# EAGLE design stepdown-power (EAGLE 5.06)
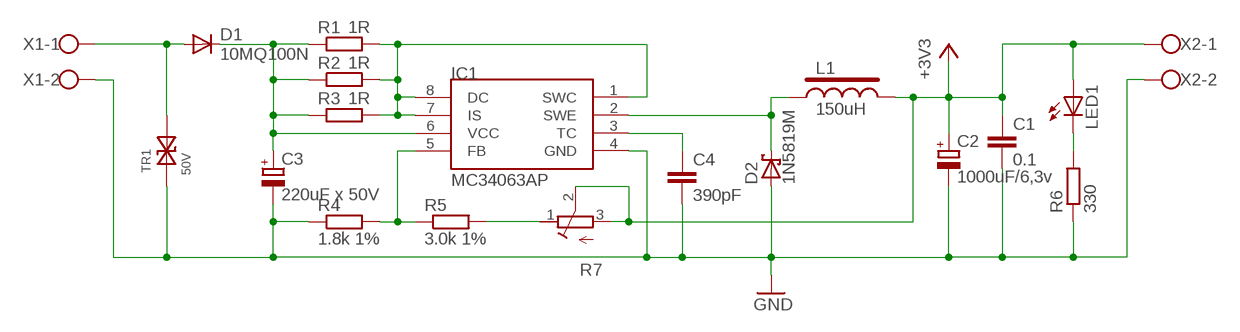
[diagram p0: schematic, sheet 1]

## Parts
C1  0.1  C-C0805  [C0805]
C2  1000uF/6,3v  CPOL-E5-10.5  [E5-10,5]
C3  220uF x 50V  CPOL-E5-10.5  [E5-10,5]
C4  390pF  C-C0805  [C0805]
D1  10MQ100N  DIODE-SMB  [SMB]
D2  1N5819M  SCHOTTKY-MELF  [MELF-MLL41]
IC1  MC34063AP  [DIL08]
L1  150uH  LRCH895  [RCH895]
LED1  LED3MM  [LED3MM]
R1  1R  R-R0805  [R0805]
R2  1R  R-R0805  [R0805]
R3  1R  R-R0805  [R0805]
R4  1.8k 1%  R-R0805  [R0805]
R5  3.0k 1%  R-R0805  [R0805]
R6  330  R-R0805  [R0805]
R7  RTRIM  [RTRIM-3362P]
TR1  50V  TRANSIL-SMB  [SMB]
X1  AK500/2  [AK500/2]
X2  AK500/2  [AK500/2]

## Nets
+3V3: C1.1 C2.+ L1.2 LED1.A R7.2(S) R7.3(E) X2.1
GND: C1.2 C2.- C3.- C4.2 D2.A IC1.4(GND) R4.1 R6.1 TR1.A X1.2 X2.2
N$1: C4.1 IC1.3(TC)
N$2: D2.C IC1.2(SWE) L1.1
N$3: LED1.K(C) R6.2
N$4: D1.A TR1.C X1.1
N$5: IC1.5(FB) R4.2 R5.1
N$6: IC1.1(SWC) IC1.7(IS) IC1.8(DC) R1.2 R2.2 R3.2
N$7: R5.2 R7.1(A)
VPOW: C3.+ D1.C IC1.6(VCC) R1.1 R2.1 R3.1

## Library data of the parts
C1 C4 = rs485:C-: CAPACITOR, European symbol
C2 C3 = rs485:CPOL-: POLARIZED CAPACITOR, European symbol
D1 = rs485:DIODE-: DIODE
D2 = rs485:SCHOTTKY-: Schottky Diode
IC1 = rs485:MC34063: 1.5 A, Step-Up/Down/Inverting Switching Regulator
L1 = rs485:L: Inductors
LED1 = rs485:LED: LED OSRAM: - CHIPLED LG R971, LG N971, LY N971, LG Q971, LY Q971, LO R971, LY R971 LH N974, LH R974 LS Q976, LO Q976, LY Q976 LO Q996 - Hyper CHIPLED LW Q18S LB Q993, LB Q99A, LB R99A - SideLED LS A670, LO A670, LY A670, LG A670, LP A670 LB A673, LV A673, LT A673, LW A673 LH A674 LY A675 LS A676, LA A676, LO A676, LY A676, LW A676 LS A679, LY A679, LG A679 - Hyper Micro SIDELED® LS Y876, LA Y876, LO Y876, LY Y876 LT Y87S - SmartLED LW L88C, LW L88S LB L89C, LB L89S, LG L890 LS L89K, LO L89K, LY L89K LS L896, LA L896, LO L896, LY L896 - TOPLED LS T670, LO T670, LY T670, LG T670, LP T670 LSG T670, LSP T670, LSY T670, LOP T670, LYG T670 LG T671, LOG T671, LSG T671 LB T673, LV T673, LT T673, LW T673 LH T674 LS T676, LA T676, LO T676, LY T676, LB T676, LH T676, LSB T676, LW T676 LB T67C, LV T67C, LT T67C, LS T67K, LO T67K, LY T67K, LW E67C LS E67B, LA E67B, LO E67B, LY E67B, LB E67C, LV E67C, LT E67C LW T67C LS T679, LY T679, LG T679 LS T770, LO T770, LY T770, LG T770, LP T770 LB T773, LV T773, LT T773, LW T773 LH T774 LS E675, LA E675, LY E675, LS T675 LS T776, LA T776, LO T776, LY T776, LB T776 LHGB T686 LT T68C, LB T68C - Hyper Mini TOPLED® LB M676 - Mini TOPLED Santana® LG M470 LS M47K, LO M47K, LY M47K Source: http://www.osram.convergy.de - LUMILED® LXK2-PW12-R00, LXK2-PW12-S00, LXK2-PW14-U00, LXK2-PW14-V00 LXK2-PM12-R00, LXK2-PM12-S00, LXK2-PM14-U00 LXK2-PE12-Q00, LXK2-PE12-R00, LXK2-PE12-S00, LXK2-PE14-T00, LXK2-PE14-U00 LXK2-PB12-K00, LXK2-PB12-L00, LXK2-PB12-M00, LXK2-PB14-N00, LXK2-PB14-P00, LXK2-PB14-Q00 LXK2-PR12-L00, LXK2-PR12-M00, LXK2-PR14-Q00, LXK2-PR14-R00 LXK2-PD12-Q00, LXK2-PD12-R00, LXK2-PD12-S00 LXK2-PH12-R00, LXK2-PH12-S00 LXK2-PL12-P00, LXK2-PL12-Q00, LXK2-PL12-R00 Source: www.luxeon.com
R1-R6 = rs485:R-: RESISTOR, European symbol
R7 = lcd-char:RTRIM
TR1 = rs485:TRANSIL-: Transil BIDIR.
X1 X2 = rs485:AK500/2: CONNECTOR

## Board
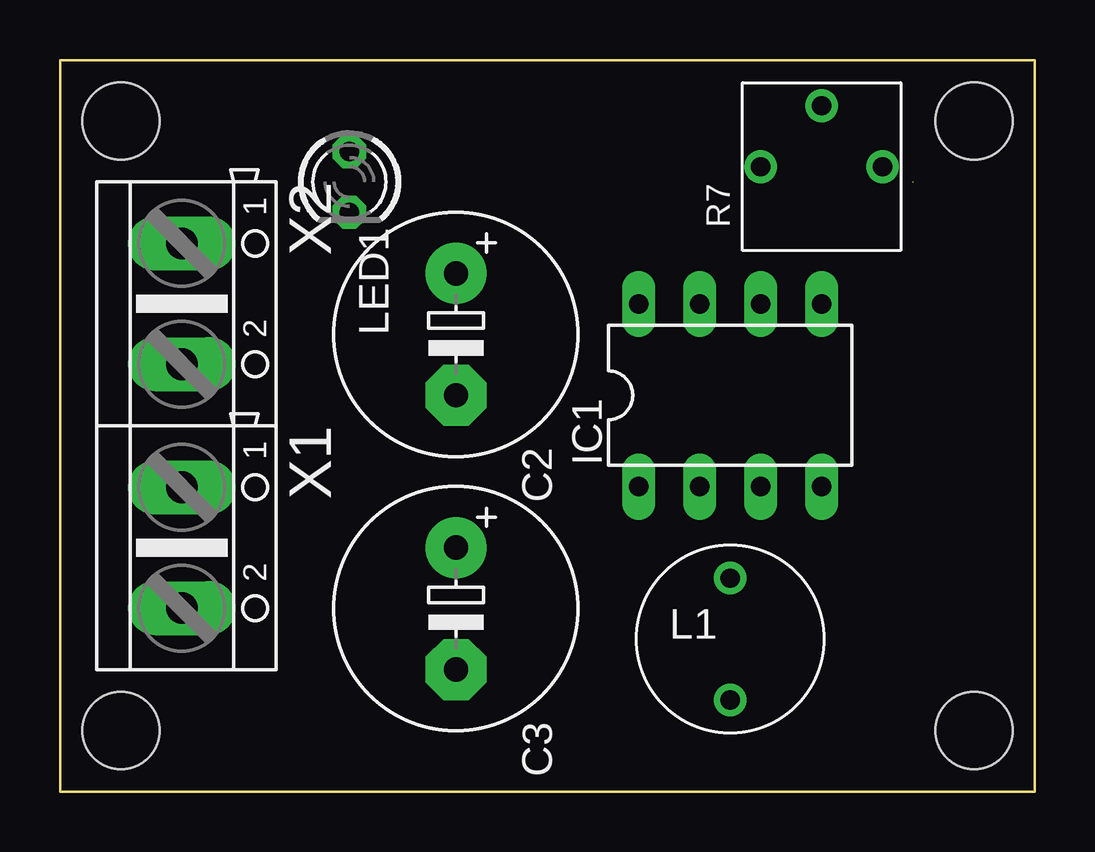
[diagram p1: board, top side]
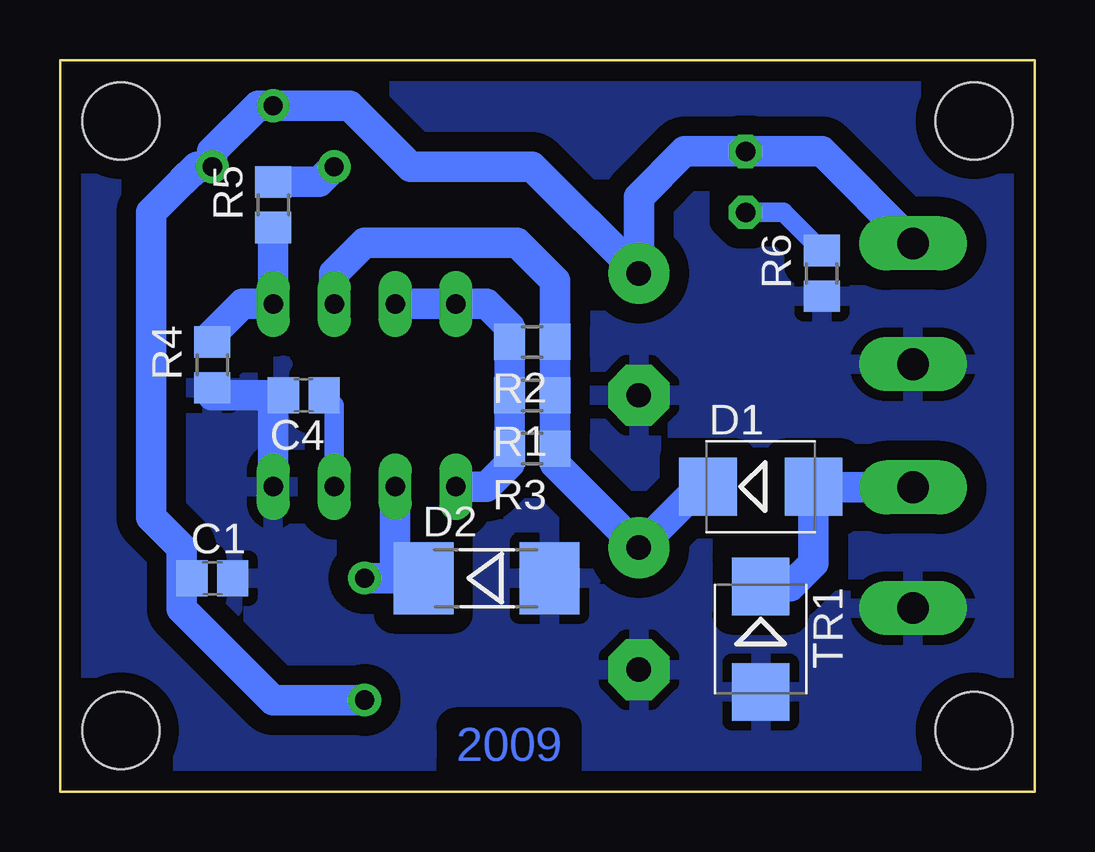
[diagram p2: board, bottom side, seen from below]

Size 40.64 x 30.48 mm. Coordinates in mm from the lower left corner, seen from the top.
Outline: 0,0 40.64,0 40.64,30.48 0,30.48 0,0
Copper layers (1*16): Top 0.035mm / dielectric 1.5mm / Bottom 0.035mm
Design rules "default *": minimum track width 10mil, minimum drill 24mil, track to track 8mil, track to pad 8mil, pad to pad 8mil, via to via 8mil, smd to smd 8mil, copper to edge 0.5mm, drill to drill 8mil, minimum pad ring 10mil, minimum via ring 8mil, stop-mask expansion 4mil, vias tented up to drill 0mil, thermal gap 16mil
Holes 3.2 mm at 2.54,2.54 38.1,2.54 38.1,27.94 2.54,27.94

### Footprints (pad centres in the part's own frame; a part is rotated, then mirrored left to right if it is on the bottom)
C0805 = smd 1.3 x 1.5: 1 -0.85,0; 2 0.85,0
E5-10,5 = drill 1.016 pad 2.54 round: + -2.54,0 | drill 1.016 pad 2.54 octagon: - 2.54,0
SMB = smd 2.4 x 2.4: A 2.2,0; C -2.2,0
MELF-MLL41 = smd 2.5 x 3: A 2.625,0; C -2.625,0
DIL08 = drill 0.813 long: 1 -3.81,-3.81; 2 -1.27,-3.81; 3 1.27,-3.81; 4 3.81,-3.81; 5 3.81,3.81; 6 1.27,3.81; 7 -1.27,3.81; 8 -3.81,3.81
RCH895 = drill 0.8 round: 1 0,2.54; 2 0,-2.54
LED3MM = drill 0.813 octagon: A -1.27,0; K 1.27,0
R0805 = smd 1.3 x 1.5: 1 -0.95,0; 2 0.95,0
RTRIM-3362P = drill 0.8 round: 1 -2.54,0; 2 0,2.54; 3 2.54,0
AK500/2 = drill 1.321 long: 1 -2.515,0; 2 2.515,0

### Placement (x,y rotation side)
C1  34.29,8.89 0 bottom
C2  16.51,19.05 270 top
C3  16.51,7.62 270 top
C4  30.48,16.51 180 bottom
D1  11.43,12.7 0 bottom
D2  22.86,8.89 0 bottom
IC1  27.94,16.51 0 top
L1  27.94,6.35 0 top
LED1  12.06,25.4 270 top
R1  20.95,16.51 180 bottom
R2  20.95,18.73 180 bottom
R3  20.95,14.29 180 bottom
R4  34.29,17.78 90 bottom
R5  31.75,24.45 90 bottom
R6  8.89,21.59 90 bottom
R7  31.75,26.04 0 top
TR1  11.43,6.35 270 bottom
X1  5.08,10.16 270 top
X2  5.08,20.32 270 top

### Tracks (layer width: path | path; a pad name or v marks a point on that pad's centre or on a via)
+3V3  (1 unrouted)
  Bottom 1.27: X2.1 5.08,22.86 8.89,26.67 LED1.A 14.61,26.67 16.51,24.77 C2.+ 20.95,26.04 26.04,26.04 28.57,28.57 R7.2 32.38,28.57 34.29,26.67 R7.3 34.92,26.04 35.56,25.4 | L1.2 31.75,3.81 35.56,7.62 35.56,8.89 | 35.56,25.4 36.83,24.13 36.83,11.43 35.56,10.16 35.56,8.89 | 35.56,8.89 C1.1
GND
  Bottom 1.27: R4.1 34.29,16.51 C4.2 31.75,16.09 IC1.4
  pour Bottom (isolate 0.813): -1.27,-1.27 41.91,-1.27 41.91,31.75 -1.27,31.75
N$1
  Bottom 0.813: C4.1 29.21,16.09 IC1.3
N$2
  Bottom 1.27: IC1.2 26.67,8.89 L1.1 D2.C
N$3
  Bottom 0.813: R6.2 10.48,24.13 LED1.K
N$4
  Bottom 1.27: X1.1 9.21,12.68 D1.A 9.23,9.5 10.18,8.55 TR1.C
N$5
  Bottom 1.27: R5.1 IC1.5 33.02,20.32 34.29,19.05 R4.2
N$6
  Bottom 1.27: IC1.7 IC1.8 22.86,20.32 21.91,19.36 R2.2 R1.2 R3.2 21.91,13.65 22.86,12.7 IC1.1
N$7
  Bottom 1.27: R5.2 29.85,25.4 R7.1
VPOW
  Bottom 1.27: IC1.6 29.21,21.59 27.94,22.86 21.59,22.86 20,21.27 R2.1 R1.1 20,16.2 20,16.19 R3.1 20,13.65 C3.+ 13.97,12.7 D1.C

### Text on the board
Bottom: 2009